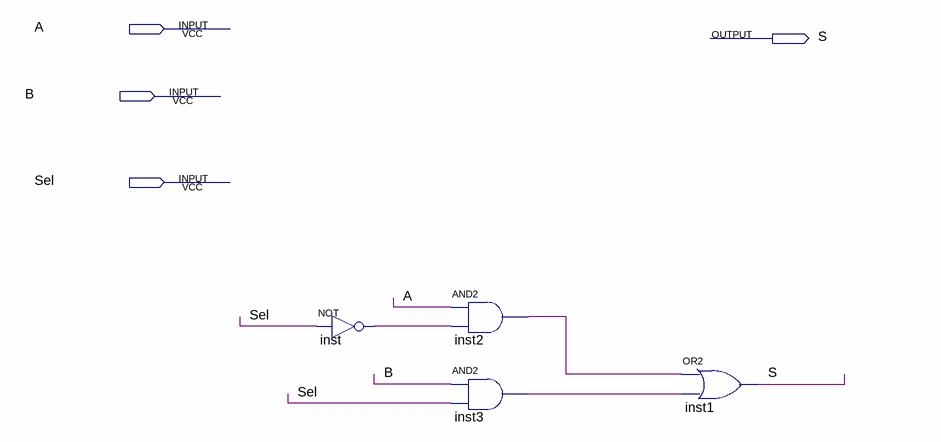
[diagram p0: schematic sheet]
// Quartus schematic MUX.bdf as structural Verilog: 4 symbols, 4 pins
module MUX (
  input  A,
  input  B,
  input  Sel,
  output S
);

  wire inst2_out, inst3_out, inst_out;

  not inst (inst_out, Sel);
  and inst2 (inst2_out, A, inst_out);
  and inst3 (inst3_out, B, Sel);
  or inst1 (S, inst2_out, inst3_out);
endmodule
